# EAGLE design ESP 32 v8 v1 (EAGLE 9.7.0)
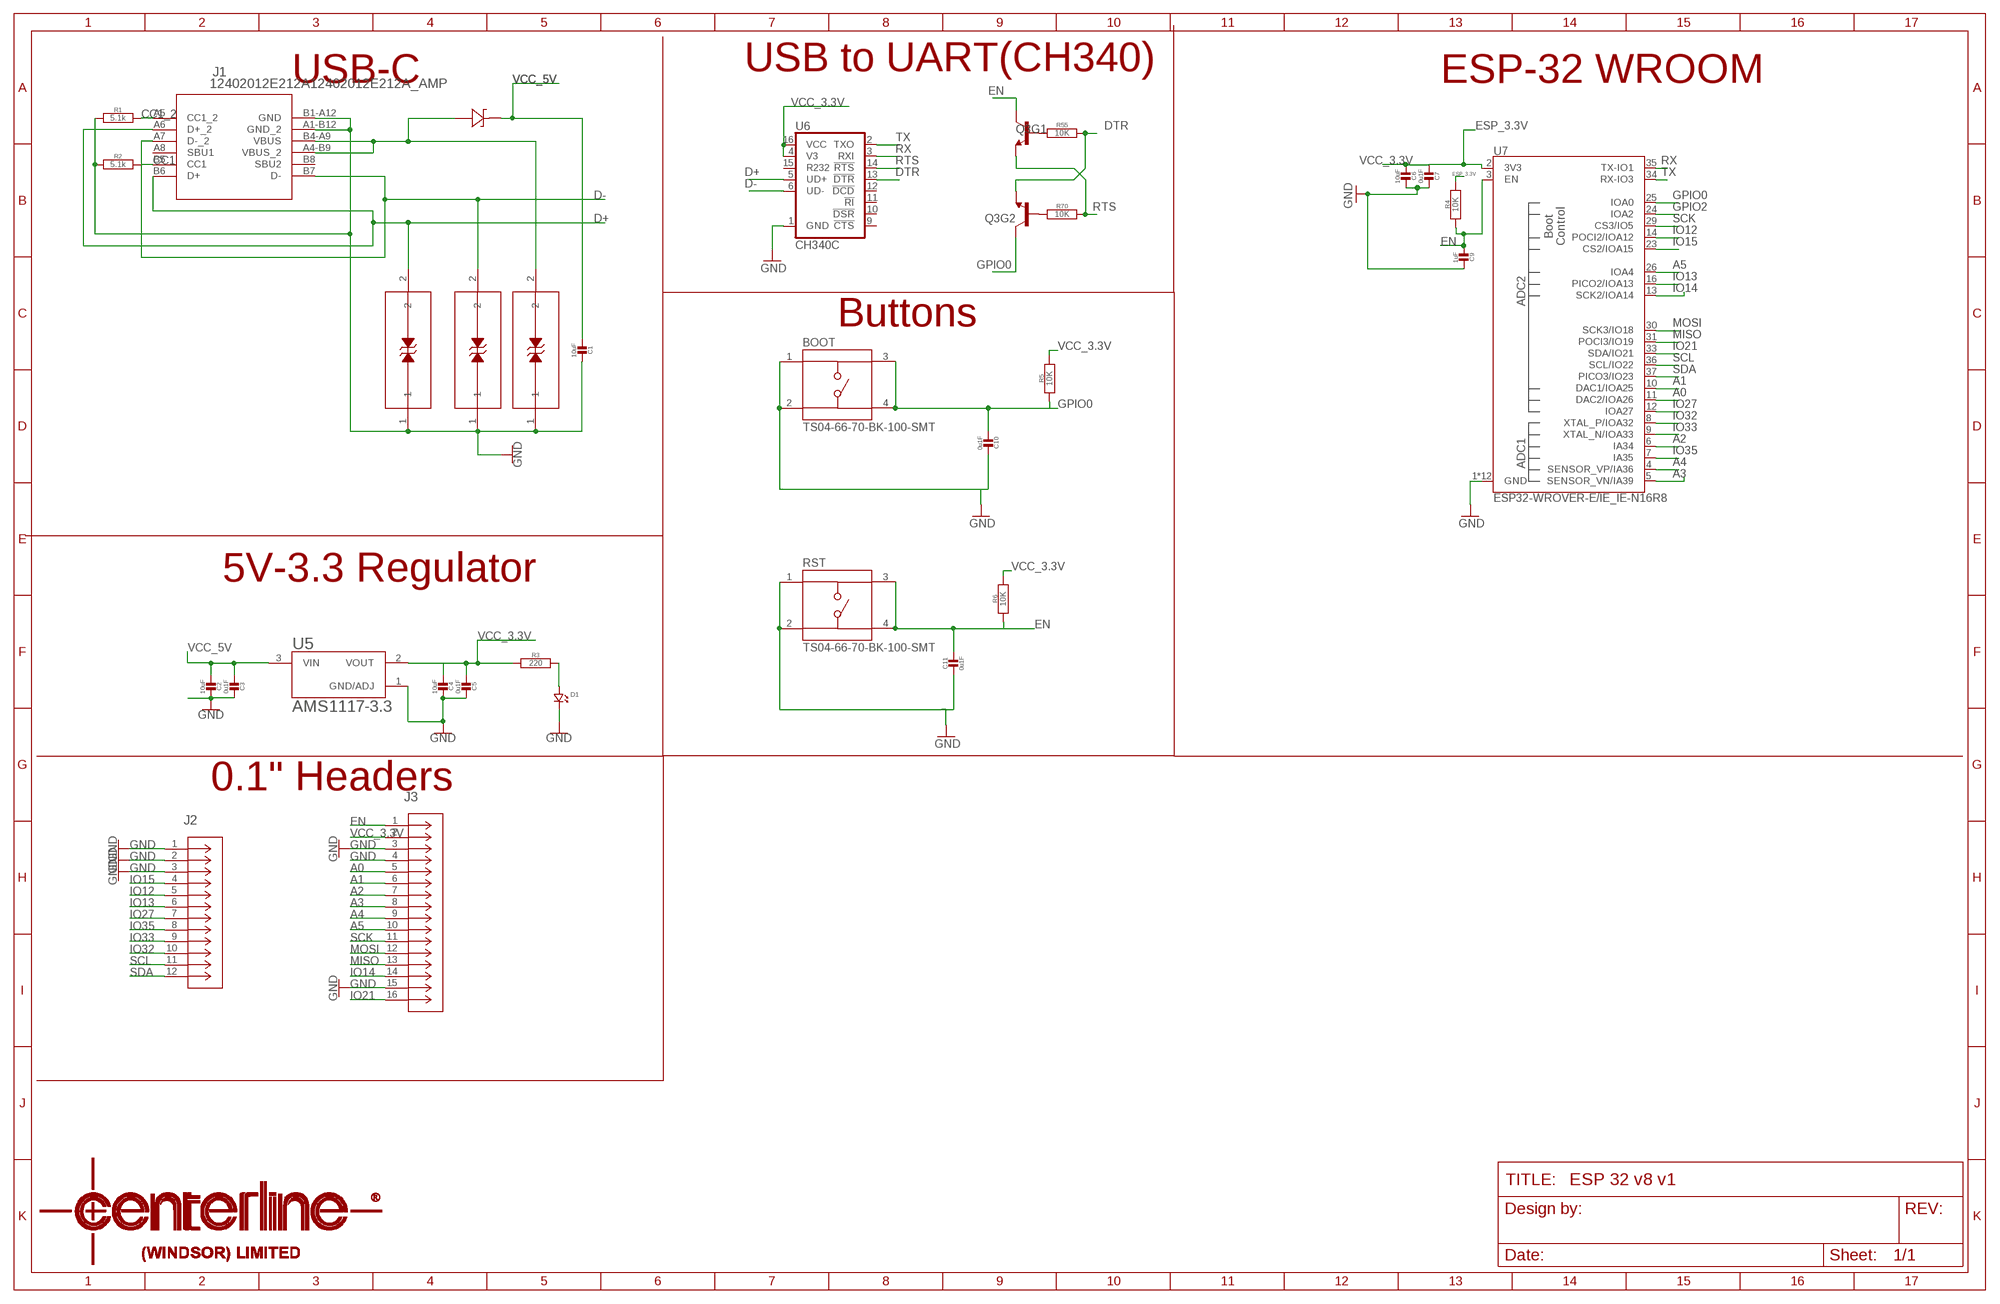
[diagram p0: schematic, sheet 1]

## Parts
BOOT  TS04-66-70-BK-100-SMT  [SW_TS04-66-70-BK-100-SMT]
C1  10uF  CAPACITOR.0603  [0603]
C2  10uF  CAPACITOR.0603  [0603]
C3  0u1F  CAPACITOR.0603  [0603]
C4  10uF  CAPACITOR.0603  [0603]
C5  0u1F  CAPACITOR.0603  [0603]
C6  10uF  CAPACITOR.0603  [0603]
C7  0u1F  CAPACITOR.0603  [0603]
C9  1uF  CAPACITOR.0603  [0603]
C10  0u1F  CAPACITOR.0603  [0603]
C11  0u1F  CAPACITOR.0603  [0603]
CR1  PESD36VS1UJXSC-90_SOD323F_NEX  [SC-90_SOD323F_NEX]
D1  LED.0402  [0402.LED]
J1  12402012E212A12402012E212A_AMP  [12402012E212A_AMP]
J2  61301211121CONN12_1211121_WRE  [CONN12_1211121_WRE]
J3  22032161CONN-4030-CTK16_MOL  [CONN-4030-CTK16_MOL]
Q3  TRANS_NPN_DUAL-MBT3904DW1T1  [SC70-6]
R1  5.1k  RESISTOR.0402  [0402]
R2  5.1k  RESISTOR.0402  [0402]
R3  220  RESISTOR.0402  [0402]
R4  10K  RESISTOR.0603  [0603]
R5  10K  RESISTOR.0603  [0603]
R6  10K  RESISTOR.0603  [0603]
R55  10K  RESISTOR.0603  [0603]
R70  10K  RESISTOR.0603  [0603]
RST  TS04-66-70-BK-100-SMT  [SW_TS04-66-70-BK-100-SMT]
U2  ESD9B5.0ST5GSOD-923_ONS-L  [SOD-923_ONS-L]
U3  ESD9B5.0ST5GSOD-923_ONS-L  [SOD-923_ONS-L]
U4  ESD9B5.0ST5GSOD-923_ONS-L  [SOD-923_ONS-L]
U5  AMS1117-3.3  [SOT229P700X180-4N]
U6  CH340C  [SO016]
U7  ESP32-WROVER-E/IE_IE-N16R8  [ESP32-WROVER-E/IE]

## Nets
A0: J3.5 U7.11(DAC2/IOA26)
A1: J3.6 U7.10(DAC1/IOA25)
A2: J3.7 U7.6(IA34)
A3: J3.8 U7.5(SENSOR_VN/IA39)
A4: J3.9 U7.4(SENSOR_VP/IA36)
A5: J3.10 U7.26(IOA4)
CC1: J1.B5(CC1) R2.2
CC1_2: J1.A5(CC1_2) R1.2
D+: J1.A6(D+_2) J1.B6(D+) U2.2 U6.5(UD+)
D-: J1.A7(D-_2) J1.B7(D-) U3.2 U6.6(UD-)
DTR: Q3.1(E) R55.2 U6.13(!DTR)
EN: C9.1 C11.1 J3.1 Q3.3(C) R4.1 R6.1 RST.3 RST.4 U7.3(EN)
ESP_3.3V: C7.1 R4.2 U7.2(3V3)
GND: BOOT.1 BOOT.2 C1.2 C2.2 C3.2 C4.2 C5.2 C6.2 C7.2 C9.2 C10.2 D1.P$2 J1.A1-B12(GND_2) J1.B1-A12(GND) J2.1 J2.2 J2.3 J3.3 J3.4 J3.15 R1.1 R2.1 U2.1 U3.1 U4.1 U5.1(GND/ADJ) U6.1(GND) U7.1(GND) U7.15(GND) U7.38(GND) U7.GND U7.GNDT1(GND) U7.GNDT2(GND) U7.GNDT3(GND) U7.GNDT4(GND) U7.GNDT5(GND) U7.GNDT6(GND) U7.GNDT7(GND) U7.GNDT8(GND)
GND1: C11.2 RST.1 RST.2
GPIO0: BOOT.3 BOOT.4 C10.1 Q3.6(C) R5.1 U7.25(IOA0)
GPIO2: U7.24(IOA2)
IO12: J2.5 U7.14(POCI2/IOA12)
IO13: J2.6 U7.16(PICO2/IOA13)
IO14: J3.14 U7.13(SCK2/IOA14)
IO15: J2.4 U7.23(CS2/IOA15)
IO21: J3.16 U7.33(SDA/IO21)
IO27: J2.7 U7.12(IOA27)
IO32: J2.10 U7.8(XTAL_P/IOA32)
IO33: J2.9 U7.9(XTAL_N/IOA33)
IO35: J2.8 U7.7(IA35)
MISO: J3.13 U7.31(POCI3/IO19)
MOSI: J3.12 U7.30(SCK3/IO18)
N$1: D1.P$1 R3.2
N$5: Q3.5(B) R55.1
N$11: Q3.2(B) R70.1
RTS: Q3.4(E) R70.2 U6.14(!RTS)
RX: U6.3(RXI) U7.35(TX-IO1)
SCK: J3.11 U7.29(CS3/IO5)
SCL: J2.11 U7.36(SCL/IO22)
SDA: J2.12 U7.37(PICO3/IO23)
TX: U6.2(TXO) U7.34(RX-IO3)
VCC_3.3V: C4.1 C5.1 C6.1 J3.2 R3.1 R5.2 R6.2 U5.2(VOUT) U6.4(V3) U6.16(VCC)
VCC_5V: C1.1 C2.1 C3.1 CR1.1 CR1.2 J1.A4-B9(VBUS_2) J1.B4-A9(VBUS) U4.2 U5.3(VIN)
Unconnected: J1.A8(SBU1) J1.B8(SBU2) U6.9(!CTS) U6.10(!DSR) U6.11(!RI) U6.12(!DCD) U6.15(R232)

## Notes on the sheet
- USB-C | USB to UART(CH340) | ESP-32 WROOM
- Buttons
- 5V-3.3 Regulator
- 0.1" Headers

## Library data of the parts
BOOT RST = TS04-66-70-BK-100-SMT:TS04-66-70-BK-100-SMT; MANUFACTURER: CUI Devices; PARTREV: 1.0; STANDARD: Manufacturer Recommendations
C1-C7 C9-C11 = CL-StandardParts:CAPACITOR
CR1 = 2024-05-29_18-45-12_Library:PESD36VS1UJX; COPYRIGHT: Copyright (C) 2024 Ultra Librarian. All rights reserved.; MANUFACTURER_PART_NUMBER: PESD36VS1UJX; MFR_NAME: Nexperia
D1 = CL-StandardParts:LED
J1 = 2024-08-19_11-27-09_Library:12402012E212A; COPYRIGHT: Copyright (C) 2024 Ultra Librarian. All rights reserved.; MANUFACTURER_PART_NUMBER: 12402012E212A; MFR_NAME: Amphenol ICC
J2 = off12pin:61301211121; COPYRIGHT: Copyright (C) 2024 Ultra Librarian. All rights reserved.; MANUFACTURER_PART_NUMBER: 61301211121; MFR_NAME: Wurth Electronics; TYPE: Headers, Male Pins
J3 = off16:22032161; COPYRIGHT: Copyright (C) 2024 Ultra Librarian. All rights reserved.; MANUFACTURER_PART_NUMBER: 22032161; MFR_NAME: Molex Connector Corporation
Q3 = SparkFun-DiscreteSemi:TRANS_NPN_DUAL: Dual NPN Transistors in Single Package The MBT3904W1 puts two general purpose 3904 NPN transistors in a single package. Datasheet <http://www.onsemi.com/pub_link/Collateral/MBT3904DW1T1-D.PDF> SparkFun Products: SparkFun ESP32 Thing <https://www.sparkfun.com/products/13907>; PROD_ID: TRANS-13337
R1 R2 R4-R6 R55 R70 = CL-StandardParts:RESISTOR
R3 = CL-StandardParts:RESISTOR; SPICEPREFIX: R
U2-U4 = protection diode :ESD9B5.0ST5G; COPYRIGHT: Copyright (C) 2024 Ultra Librarian. All rights reserved.; MANUFACTURER_PART_NUMBER: ESD9B5.0ST5G; MFR_NAME: onsemi
U5 = AMS1117-3.3:AMS1117-3.3: Check availability <https://pricing.snapeda.com/parts/AMS1117-3.3/Advanced%20Monolithic%20Systems/view-part?ref=eda>; AVAILABILITY: Not in stock; CHECK_PRICES: https://www.snapeda.com/parts/AMS1117-3.3/Advanced+Monolithic+Systems/view-part/?ref=eda; DESCRIPTION: Sot223/Pkg 1-Amp 3.3-Volt Low Drop Out Voltage Regulatator; MF: Advanced Monolithic Systems; MP: AMS1117-3.3; PACKAGE: SOT-223 Seeed Technology; PRICE: None; SNAPEDA_LINK: https://www.snapeda.com/parts/AMS1117-3.3/Advanced+Monolithic+Systems/view-part/?ref=snap
U6 = SparkFun-IC-Comms:CH340C; PROD_ID: IC-14038
U7 = SparkFun-RF:ESP32-WROVER-E/IE: ESP32-WROVER-E/IE ESP32-WROVER-E uses the onboard antenna. ESP32-WROVER-IE has a u.FL antenna connector, but is otherwise the same as the -E. N16R8 has 16M Flash, 8M PSRAM; PROD_ID: IC-19265

## Net classes
3 GND: width 0.254 mm

## Board
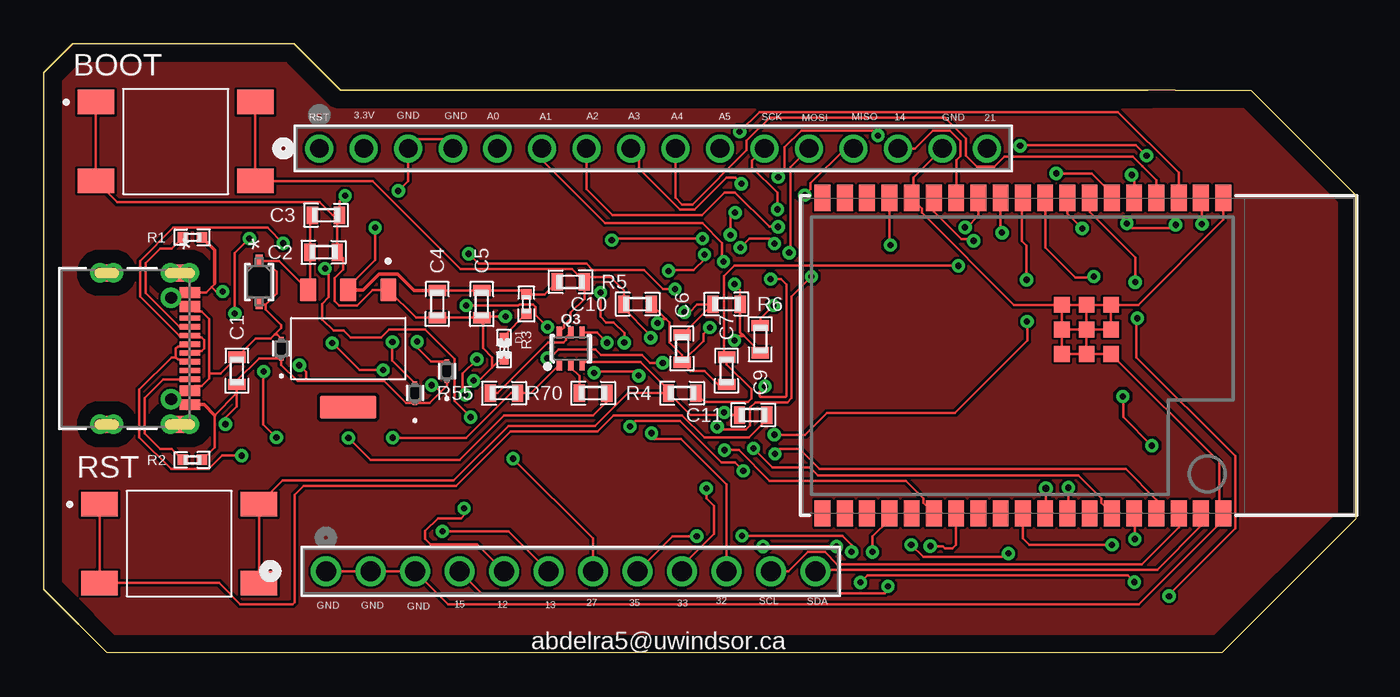
[diagram p1: board, top side]
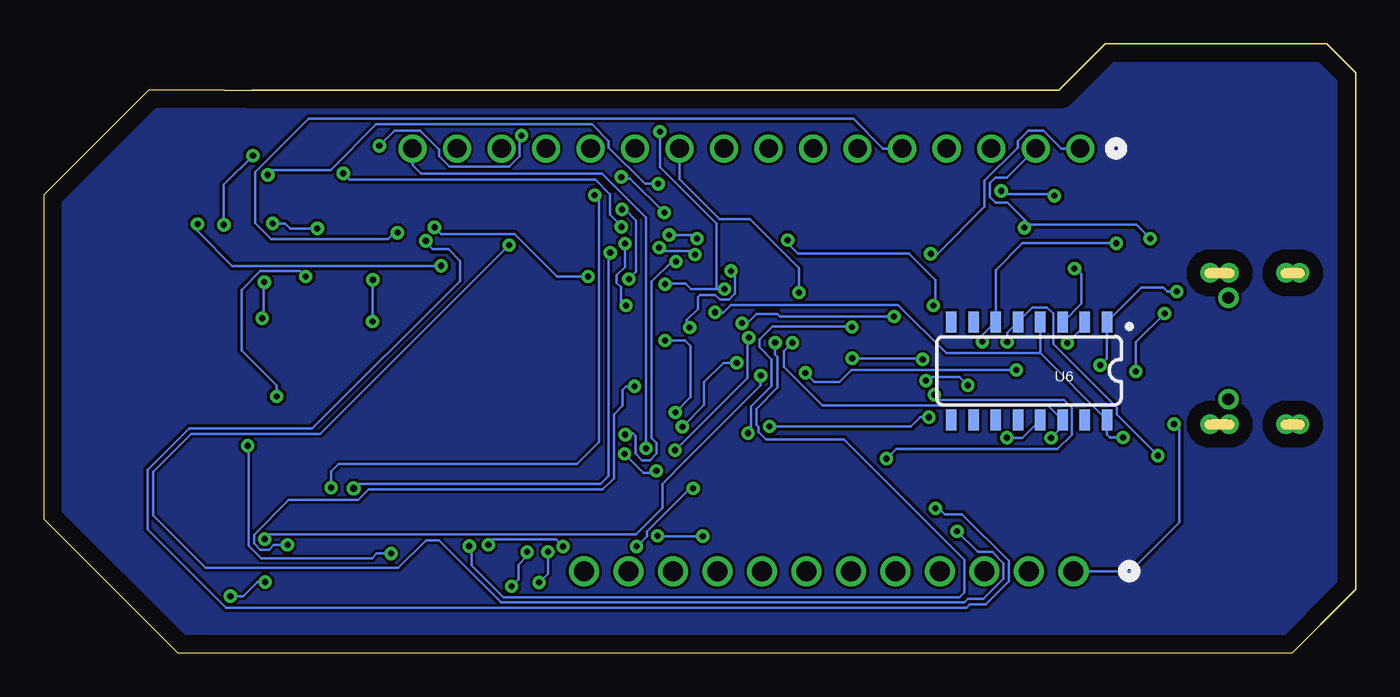
[diagram p2: board, bottom side, seen from below]

Size 74.85 x 34.76 mm. Coordinates in mm from the lower left corner, seen from the top.
Outline: 0,3.61 0,33.11 1.66,34.76 14.28,34.76 16.94,32.11 62.99,32.11 64.57,32.11 68.88,32.11 74.85,26.14 74.85,7.65 67.2,0 46.98,0 3.61,0 0,3.61
Outline: 0,3.61 1.98,1.63
Copper layers (1*16): Top / Bottom
Stack-up Default Layer Stack: Top User Defined 0.035mm / Dielectric-1 User Defined 1.5mm / Bottom User Defined 0.035mm
Design rules: minimum copper width class=3 10mil, minimum copper width 6mil, minimum drill size 0.35mm, copper clearance wire_polygon to wire_polygon 6mil, copper clearance wire_polygon to pad_smd 6mil, copper clearance wire_polygon to via 6mil, copper clearance pad_smd to pad_smd 6mil, copper clearance pad_smd to via 6mil, copper clearance via to via 6mil, copper clearance smd to pad (same net) 6mil, copper clearance smd to via (same net) 6mil, copper clearance smd to smd (same net) 6mil, dimension clearance 40mil, via restrict clearance 0mil, restrict clearance 0mil, drill distance 6mil, keepout clearance 0mil

### Footprints (pad centres in the part's own frame; a part is rotated, then mirrored left to right if it is on the bottom)
SW_TS04-66-70-BK-100-SMT = smd 2.1 x 1.4: 1 -4.55,2.25; 2 -4.55,-2.25; 3 4.55,2.25; 4 4.55,-2.25
0603 = smd 0.65 x 1: 1 -0.775,0; 2 0.775,0
SC-90_SOD323F_NEX = smd 0.711 x 0.406: 1 -1.194,0; 2 1.194,0
0402.LED = smd 0.7 x 0.5: P$1 -0.55,0; P$2 0.55,0
12402012E212A_AMP = smd 0.991 x 2.108: 13 -4.32,3.1; 14 4.32,3.1 | smd 0.991 x 1.803: 15 -4.32,-1.08; 16 4.32,-1.08 | drill 0.66 pad 0.66: 17 -2.89,2.6; 18 2.89,2.6 | smd 0.61 x 1.143: A1-B12 -3.2,3.67; A4-B9 -2.4,3.67; B1-A12 3.2,3.67; B4-A9 2.4,3.67 | smd 0.305 x 1.143: A5 -1.25,3.67; A6 -0.25,3.67; A7 0.25,3.67; A8 1.25,3.67; B5 1.75,3.67; B6 0.75,3.67; B7 -0.75,3.67; B8 -1.75,3.67 | drill 0.61 pad 0.61: S_2_H1 -4.32,3.646; S_2_H2 -4.32,2.554; S_3_H1 4.32,3.646; S_3_H2 4.32,2.554; S_4_H1 -4.32,-0.686; S_4_H2 -4.32,-1.473; S_5_H1 4.32,-0.686; S_5_H2 4.32,-1.473
CONN12_1211121_WRE = drill 1.143 pad 1.651: 1 0,0; 2 2.54,0; 3 5.08,0; 4 7.62,0; 5 10.16,0; 6 12.7,0; 7 15.24,0; 8 17.78,0; 9 20.32,0; 10 22.86,0; 11 25.4,0; 12 27.94,0
CONN-4030-CTK16_MOL = drill 1.067 pad 1.575: 1 0,0; 2 -2.54,0; 3 -5.08,0; 4 -7.62,0; 5 -10.16,0; 6 -12.7,0; 7 -15.24,0; 8 -17.78,0; 9 -20.32,0; 10 -22.86,0; 11 -25.4,0; 12 -27.94,0; 13 -30.48,0; 14 -33.02,0; 15 -35.56,0; 16 -38.1,0
SC70-6 = smd 0.3 x 0.66: 1 -0.65,-0.92; 2 0,-0.92; 3 0.65,-0.92; 4 0.65,0.92; 5 0,0.92; 6 -0.65,0.92
0402 = smd 0.6 x 0.6: 1 -0.55,0; 2 0.55,0
SOD-923_ONS-L = smd 0.229 x 0.254: 1 -0.559,0; 2 0.559,0
SOT229P700X180-4N = smd 1.31 x 0.93: 1 -3.345,2.29; 2 -3.345,0; 3 -3.345,-2.29 | smd 1.31 x 3.24: 4 3.345,0
SO016 = smd 0.6 x 1.2: 1 -4.445,-2.8; 2 -3.175,-2.8; 3 -1.905,-2.8; 4 -0.635,-2.8; 5 0.635,-2.8; 6 1.905,-2.8; 7 3.175,-2.8; 8 4.445,-2.8; 9 4.445,2.8; 10 3.175,2.8; 11 1.905,2.8; 12 0.635,2.8; 13 -0.635,2.8; 14 -1.905,2.8; 15 -3.175,2.8; 16 -4.445,2.8
ESP32-WROVER-E/IE = smd 0.9 x 1.5: 1 7.8,9; 2 6.53,9; 3 5.26,9; 4 3.99,9; 5 2.72,9; 6 1.45,9; 7 0.18,9; 8 -1.09,9; 9 -2.36,9; 10 -3.63,9; 11 -4.9,9; 12 -6.17,9; 13 -7.44,9; 14 -8.71,9; 15 -9.98,9; 16 -11.25,9; 17 -12.52,9; 18 -13.79,9; 19 -15.06,9; 20 -15.06,-9; 21 -13.79,-9; 22 -12.52,-9; 23 -11.25,-9; 24 -9.98,-9; 25 -8.71,-9; 26 -7.44,-9; 27 -6.17,-9; 28 -4.9,-9; 29 -3.63,-9; 30 -2.36,-9; 31 -1.09,-9; 32 0.18,-9; 33 1.45,-9; 34 2.72,-9; 35 3.99,-9; 36 5.26,-9; 37 6.53,-9; 38 7.8,-9 | smd 0.9 x 0.9: GND 0,1.5; GNDT1 -1.4,2.9; GNDT2 -1.4,1.5; GNDT3 -1.4,0.1; GNDT4 0,0.1; GNDT5 1.4,0.1; GNDT6 1.4,1.5; GNDT7 1.4,2.9; GNDT8 0,2.9

### Placement (x,y rotation side)
BOOT  7.52,29.19 0 top
C1  11.02,16.09 270 top
C2  15.96,22.86 0 top
C3  16.1,24.98 0 top
C4  22.45,19.9 270 top
C5  24.99,19.9 270 top
C6  36.42,17.36 270 top
C7  38.96,16.09 270 top
C9  40.88,17.91 90 top
C10  33.88,19.9 0 top
C11  40.47,13.57 0 top
CR1  12.29,21.17 270 top
D1  26.26,17.36 270 top
J1  4.67,17.36 270 top
J2  16.1,4.66 0 top
J3  15.72,28.79 180 top
Q3  30.07,17.36 0 top
R1  8.48,23.71 180 top
R2  8.48,11.01 180 top
R3  27.53,19.9 270 top
R4  36.42,14.82 0 top
R5  30.07,21.17 180 top
R6  38.96,19.9 180 top
R55  26.26,14.82 0 top
R70  31.34,14.82 0 top
RST  7.73,6.23 0 top
U2  21.18,14.82 90 top
U3  23,16.08 90 top
U4  13.56,17.36 90 top
U5  17.37,17.36 270 top
U6  18.64,16.09 180 bottom
U7  59.49,16.96 0 top

### Tracks (layer width: path | path; a pad name or v marks a point on that pad's centre or on a via)
A0  (via drill 0.35)
  Top 0.152: v54.67,23.98 54.59,24.07 U7.11
  Bottom 0.152: J3.5 26.96,28.79 28.66,30.49 59.74,30.49 62.8,27.43 62.8,24.53 61.89,23.62 55.22,23.62 54.86,23.98 v54.67,23.98
A1  (via drill 0.35)
  Top 0.152: J3.6 28.42,28.12 32.02,24.52 37.57,24.52 38.7,23.39 38.7,22.44 38.85,22.28 38.84,22.28 v38.79,22.33 | v41.68,12.45 43.44,12.45 44.68,13.7 52,13.7 56.12,17.82 56.12,18.89 v56.1,18.91 | v56.07,21.29 56.07,23.23 55.81,23.5 55.81,25.91 U7.10
  Bottom 0.152: v38.79,22.33 39.02,22.33 40.17,21.18 40.17,12.27 39.88,11.98 39.88,11.37 40.26,10.99 40.72,10.99 41.1,11.38 41.1,12.39 41.23,12.52 41.61,12.52 v41.68,12.45 | v56.07,21.29 56.1,21.27 v56.1,18.91
A2  (via drill 0.35)
  Top 0.152: J3.7 30.96,26.46 32.44,24.99 37.54,24.99 38.84,26.28 39.43,26.28 41.4,24.32 v41.9,24.32 | U7.6 60.94,26.22 59.79,27.37 v57.76,27.37
  Bottom 0.152: v57.76,27.37 57.75,27.37 57.4,27.01 43.38,27.01 42.53,26.17 42.53,25 41.9,24.37 v41.9,24.32
A3  (via drill 0.35)
  Top 0.152: J3.8 33.95,28.34 33.95,27.63 36.29,25.29 37.13,25.29 38.95,27.12 39.46,27.12 v39.8,26.78 v39.8,26.77 | v62.07,27.28 62.21,27.14 U7.5
  Bottom 0.152: v39.8,26.77 40.55,26.77 42.63,28.85 42.63,29.22 43.58,30.17 55.89,30.17 58.49,27.57 61.79,27.57 v62.07,27.28
A4
  Top 0.152: U7.4 63.48,26.98 62.68,27.78 62.67,27.78 62.13,28.32 54.81,28.32 54.23,27.74 53.24,27.74 52.61,28.37 52.61,29.34 51.4,30.55 41.42,30.55 40.09,29.22 40.09,28.68 37,25.59 36.42,25.59 36.04,25.97 J3.9
A5  (via drill 0.35)
  Top 0.152: U7.26 52.05,6.17 51.84,5.95 51.42,5.95 51.29,6.09 v50.58,6.09 | v31.77,20.57 v31.76,20.56 31.76,19.19 32.09,18.87 32.51,18.87 33.12,18.26 v33.12,17.7
  Bottom 0.152: v50.58,6.09 50.44,5.95 50.44,4.99 48.63,3.18 22.6,3.18 22.32,3.45 22.32,5.32 29.2,12.19 33.66,12.19 34.07,12.6 34.07,12.9 34.19,13.02 34.19,13.93 32.98,15.14 32.98,16.89 33.12,17.03 v33.12,17.7 | v31.77,20.57 31.77,21.95 34.57,24.75 36.29,24.75 38.58,27.04 J3.10
CC1
  Top 0.152: R2.2 7.29,11.65 6.64,11.65 5.75,12.54 5.75,14.56 6.81,15.61 J1.B5
CC1_2
  Top 0.152: J1.A5 7.72,18.61 5.8,20.54 5.8,22.24 6.64,23.08 7.29,23.08 R1.2
D+  (via drill 0.35)
  Top 0.152: v19.88,17.74 19.88,16.68 U2.2 | 7.54,16.87 7.67,16.73 8.22,16.73 J1.B6 | 7.54,16.87 7.54,17.36 7.67,17.5 8.22,17.5 J1.A6 | 7.54,16.87 7.29,16.87 5.45,15.03 5.45,12.31 7.27,10.49 9.42,10.49 10.19,11.25 v11.29,11.25
  Bottom 0.152: v19.88,17.74 19.88,18.28 U6.5 18.44,19.72 17.61,19.72 17.26,19.38 17.26,17.62 13.64,14 13.64,13.6 v11.29,11.25
D-  (via drill 0.35, 0.35 pad 0.43)
  Top 0.152: U3.2 22.09,16.64 21.33,17.39 21.33,17.76 v21.3,17.76 | v13.65,23.37 12.76,24.27 7.4,24.27 5.49,22.37 5.49,20.34 7.72,18.11 J1.B7 8.45,18 9,18 9.14,17.86 9.14,17.37 9,17.23 8.45,17.23 J1.A7
  Bottom 0.152: v21.3,17.76 21.33,17.79 21.33,18.11 U6.6 20.54,21.85 19.01,23.39 v13.67,23.39 v13.65,23.37
DTR  (via drill 0.35)
  Top 0.152: Q3.1 27.8,14.82 R55.2 26.65,14.82 24.11,12.28 v19.9,12.28 | v19.9,12.28
  Bottom 0.152: v19.9,12.28 19.02,12.28 U6.13
EN  (via drill 0.35)
  Top 0.152: Q3.3 30.87,16.6 34.05,16.6 35.64,15.01 R4.1 | RST.4 RST.3 13.62,9.83 23.39,9.83 26.51,12.94 31.46,12.94 33.34,14.82 R4.1 | R4.1 36.89,13.58 38.95,13.58 | v24.24,22.77 24.81,22.21 30.96,22.21 31.3,21.86 34.24,21.86 35.33,20.77 v36.02,20.77 | v39.41,21.04 39.73,20.72 R6.1 39.73,18.28 39.94,18.07 | U7.3 64.75,27.41 61.29,30.87 40.83,30.87 v39.7,29.74 | C11.1 38.95,13.57 38.95,13.58 | 39.94,18.07 C9.1 | 39.94,18.07 39.65,18.07 v39.41,17.83 | v38.82,13.72 v38.82,13.71 38.95,13.58
  Bottom 0.152: J3.1 16.8,28.79 17.83,29.82 18.68,29.82 19.29,29.22 19.29,28.84 21.18,26.95 21.18,25.46 23.87,22.77 v24.24,22.77 | v36.02,20.77 36.46,20.77 | 36.46,20.77 37.93,20.77 38.24,21.08 39.37,21.08 v39.41,21.04 | 36.46,20.77 36.46,24.49 39.7,27.74 v39.7,29.74 | v39.41,17.83 38.27,17.83 37.94,17.5 37.94,14.59 v38.82,13.72
ESP_3.3V  (via drill 0.35)
  Top 0.152: v52.18,22.09 52.16,22.11 39.42,22.11 38.8,21.49 38.8,17.02 C7.1 38.96,16.47 40.37,15.05 40.37,14.51 40.19,14.32 37.69,14.32 R4.2 | U7.2 66.08,25.9 v66.08,24.48
  Bottom 0.152: v52.18,22.09 64.11,22.09 66.08,24.06 v66.08,24.48
GND  (via drill 0.35)
  Top 0.152: C6.2 36.91,16.09 37.69,16.09 38.46,15.32 C7.2 | 35.51,19.05 35.69,18.87 35.69,17.72 36.42,16.99 C6.2 | 35.51,19.05 C10.2 | C1.2 11.02,14.82 | 11.02,14.82 9.75,13.55 9.75,11.73 R2.1 | U2.1 | U2.1 20.68,14.27 19.42,15.52 14.97,15.52 | BOOT.1 BOOT.2 4.2,25.71 15.74,25.71 16.47,24.98 C3.2 | U7.GNDT8 59.49,19.82 59.45,19.86 U7.GNDT1 | 9.75,21.11 9.75,21.05 9.58,20.88 | 9.58,20.88 9.26,20.56 J1.A1-B12 | 9.58,20.88 9.85,20.62 v10.2,20.62 | U7.GNDT7 U7.GNDT8 | 59.59,17.06 U7.GNDT5 67.06,10.89 67.06,8.19 U7.38 67.29,7.58 62.48,2.76 23.08,2.76 J2.3 J2.2 J2.1 | 58.17,17.06 U7.GNDT4 59.59,17.06 | 58.17,17.06 U7.GNDT3 | U7.GNDT1 58.09,17.14 58.17,17.06 | U7.GNDT8 59.49,18.52 | 59.49,18.52 59.49,17.16 59.59,17.06 | U7.GNDT7 62.45,19.86 67.31,24.72 67.31,25.95 U7.1 | U7.GNDT1 55.36,19.86 50.1,25.12 50.1,25.37 U7.15 49.63,25.96 49.62,25.97 49.62,27.12 51.28,28.78 J3.15 | J3.4 22.79,29.33 21.34,29.33 J3.3 20.8,26.94 v20.22,26.37 | C3.2 16.87,25.77 v17.19,26.09 | v10.36,13.05 10.36,13.4 11.02,14.06 11.02,14.82 | U2.1 22.01,14.27 22.01,14.26 22.63,14.88 | 22.63,14.88 23,15.25 U3.1 | 11.02,15.54 12.29,16.81 U4.1 13.56,16.44 14.47,15.52 14.97,15.52 | C3.2 16.73,24.85 C2.2 17.07,22.53 17.07,21.87 16.58,21.38 16.58,20.09 16.85,19.83 17.88,19.83 18.77,20.71 U5.1 21.24,19.13 C4.2 C5.2 25.06,19.2 | 25.06,19.2 v26.34,19.2 | v35.01,18.82 35.25,19.05 35.51,19.05 | U7.GNDT2 59.43,18.46 59.49,18.52 | C6.2 37.63,17.8 37.63,18.2 v38,18.57 | v35.65,21.8 35.69,21.85 37.08,21.85 37.75,22.52 37.75,22.81 37.7,22.76 v37.7,22.74 | v39.74,23.13 40.26,23.65 41.4,23.65 v41.69,23.36 | v41.64,19.83 40.88,19.07 C9.2 | v14.58,16.41 14.97,16.02 14.97,15.52
  Top 0.152: 22.63,14.88 22.24,15.27 v22.12,15.27 | v24.52,15.54 24.83,15.54 25.58,16.29 | 25.58,16.29 26.1,16.81 D1.P$2 | 25.58,16.29 25.58,16.87 25.06,17.39 25.06,19.2 | U7.GND U7.GNDT6 U7.GNDT7
  Top 0.2: J1.B1-A12 9.14,14.16 9.75,13.55 | R1.1 9.75,22.99 9.75,21.11 | 11.02,15.54 C1.2
  Bottom 0.152: v10.2,20.62 10.74,20.62 10.97,20.85 12.24,20.85 U6.1 14.19,16.8 v14.58,16.41 | J2.1 12.85,4.66 10.06,7.46 10.06,12.75 v10.36,13.05 | v35.01,18.82 34.71,18.82 34.17,19.35 32.99,19.35 32.84,19.2 v26.34,19.2 | v35.65,21.8 35.41,21.57 35.41,20.52 35.77,20.16 36.27,20.16 36.54,20.43 37.41,20.43 37.53,20.31 37.53,19.64 38.17,19 38.17,18.74 v38,18.57 | v37.7,22.74 37.7,22.76 37.88,22.94 39.55,22.94 v39.74,23.13 | v41.64,19.83 41.89,19.83 41.92,19.86 41.92,20.86 42.17,21.11 42.17,21.55 41.69,22.02 v41.69,23.36 | v22.12,15.27 22.61,15.76 24.3,15.76 v24.52,15.54 | v17.19,26.09 17.29,26.2 20.05,26.2 v20.22,26.37
GND1
  Top 0.152: RST.1 RST.2 10,3.98 11.2,2.78 14.2,2.78 14.3,2.89 14.3,9 14.83,9.52 23.52,9.52 26.63,12.64 31.59,12.64 32.5,13.55 36.42,13.55 37.69,12.28 40.23,12.28 41.24,13.3 C11.2
GPIO0  (via drill 0.35)
  Top 0.152: Q3.6 29.69,18.56 29.69,18.71 30.07,19.09 30.07,19.42 30.84,20.19 R5.1 | BOOT.3 BOOT.4 18.75,26.94 23.78,21.9 30.13,21.9 R5.1 | U7.25 50.19,8.55 50.19,8.81 49.18,9.82 41.41,9.82 39.66,11.57 v38.84,11.57 | R5.1 31.12,21.46 32.33,21.46 33.1,20.68 C10.1 33.04,19.85 33.04,19.71 34.63,18.12 v34.63,17.99
  Bottom 0.152: v38.84,11.57 38.81,11.57 34.7,15.68 34.7,17.92 v34.63,17.99
IO12  (via drill 0.35)
  Top 0.152: U7.14 50.78,25.19 52.36,23.61 52.97,23.61 v53.05,23.52 | J2.5 24.72,6.2 22.08,6.2 21.77,6.51 21.77,6.95 22.49,7.68 23.8,7.68 24.08,7.95 24.08,8.14 v23.98,8.25
  Bottom 0.152: v23.98,8.25 23.78,8.25 23.45,7.91 22.46,7.91 19.78,5.24 19.78,4.09 21.11,2.76 22.01,2.76 22.2,2.57 64.45,2.57 68.92,7.05 68.92,10.45 66.56,12.81 59.53,12.81 51.11,21.23 51.11,22.37 51.77,23.03 52.68,23.03 53.05,23.41 v53.05,23.52
IO13  (via drill 0.35)
  Top 0.152: U7.16 48.24,23.34 v48.31,23.28 | v22.74,6.93 26.53,6.93 J2.6
  Bottom 0.152: v48.31,23.28 59.08,12.51 66.44,12.51 68.62,10.32 68.62,7.85 65.61,4.84 54.62,4.84 53.05,6.42 52.3,6.42 48.75,2.87 22.33,2.87 22.13,3.07 21.23,3.07 20.09,4.21 20.09,5.11 20.73,5.75 21.56,5.75 v22.74,6.93
IO14
  Top 0.152: J3.14 49.69,28.79 50.72,29.82 51.7,29.82 52.31,29.22 52.31,28.36 52.06,28.12 U7.13
IO15  (via drill 0.35)
  Top 0.152: J2.4 24.99,3.39 47.98,3.39 48.16,3.57 v48.16,3.79 | U7.23 48.24,7.6 47.28,6.64 v47.28,5.75
  Bottom 0.152: v48.16,3.79 47.77,4.19 47.77,5.03 47.28,5.53 47.28,5.68 v47.28,5.75
IO21  (via drill 0.35)
  Top 0.152: U7.33 60.35,8.55 60.35,8.81 59.03,10.12 44.17,10.12 43.71,10.58 41.58,10.58 40.5,11.66 v40.5,11.67
  Bottom 0.152: v40.5,11.67 v40.49,11.67 40.49,24.83 43.01,27.35 53.31,27.35 53.82,27.85 J3.16
IO27  (via drill 0.35)
  Top 0.152: U7.12 53.32,24.95 52.66,24.29 v52.56,24.29 | v43.8,21.47 42.67,20.34 42.67,14.54 42.44,14.31 40.6,14.31 40.29,14 40.29,12.99 40.06,12.75 38.48,12.75 38.42,12.82 v38.42,12.9 | v28.73,16.81 28.7,16.81 28.62,16.89 28.93,16.89 29.36,17.32 31.47,17.32 31.8,16.99 34.14,16.99 34.58,16.55 v35.31,16.55 | v24.71,16.75 23.91,15.95 23.91,14.74 23.91,14.73 v24.04,14.73 | v26.78,11.08 31.34,6.53 J2.7
  Bottom 0.152: v43.8,21.47 45.57,21.47 48,23.9 52.18,23.9 v52.56,24.29 | v38.42,12.9 37.18,14.14 37.18,15.45 36.07,16.55 v35.31,16.55 | v28.73,16.81 24.92,16.81 24.85,16.74 24.72,16.74 v24.71,16.75 | v24.04,14.73 23.74,14.43 16.64,14.43 16.2,13.99 16.2,12.45 17.01,11.64 26.21,11.64 v26.77,11.08 v26.78,11.08
IO32  (via drill 0.35)
  Top 0.152: J2.10 38.96,9.6 36.36,12.2 34.83,12.2 34.68,12.35 v34.68,12.54 | v28.73,18.59 28.05,19.27 28.05,19.75 27.92,19.88 27.13,19.88 27.07,19.82 v24.1,19.82 v24.09,19.82 | v32.4,23.56 32.5,23.66 37.57,23.66 v37.58,23.65 | v39.17,23.85 39.17,24.87 39.43,25.12 v39.45,25.12 | v41.9,27.16 42.27,27.53 42.27,28.86 43.23,29.82 47.29,29.82 v47.59,29.53 | v55.71,28.94 55.76,28.99 62.32,28.99 v62.92,28.39 | U7.8 58.4,25.07 v59.25,24.23 | v61.8,24.51 62.07,24.23 64.38,24.23 v64.58,24.43
  Bottom 0.152: v34.68,12.54 34.5,12.72 34.5,14.05 33.33,15.22 33.33,16.75 34.02,17.45 34.02,17.89 33.28,18.62 28.76,18.62 v28.73,18.59 | v24.09,19.82 23.98,19.94 23.98,21.29 25.48,22.79 31.83,22.79 32.4,23.36 v32.4,23.56 | v37.58,23.65 37.79,23.85 v39.17,23.85 | v39.45,25.12 41.39,27.07 41.81,27.07 v41.9,27.16 | v47.59,29.53 47.71,29.41 47.71,28.36 48.31,27.76 51.7,27.76 52.31,28.36 52.31,28.73 53.39,29.82 54.83,29.82 v55.71,28.94 | v59.25,24.23 60.8,24.23 61.08,24.51 v61.8,24.51 | v64.58,24.43 64.58,26.72 v62.92,28.39
IO33  (via drill 0.35)
  Top 0.152: J2.9 36.42,4.96 38.24,6.78 38.24,8.39 37.8,8.83 v37.8,9.38 | v41.03,6.07 v45.23,6.07 | v49.49,6.16 50.18,5.47 54.66,5.47 54.87,5.67 v55.04,5.67 | v63.22,11.82 61.58,13.46 61.58,14.62 v61.57,14.64 | v59.91,21.48 59.86,21.43 58.85,21.43 57.15,23.13 57.15,25.94 U7.9
  Bottom 0.152: v41.03,6.07 40.44,6.66 40.44,6.93 37.98,9.38 v37.8,9.38 | v45.23,6.07 45.63,6.47 49.25,6.47 49.49,6.23 v49.49,6.16 | v63.22,11.82 63.29,11.75 63.29,11.7 63.16,11.57 63.16,6.11 62.45,5.41 56.12,5.41 55.86,5.67 v55.04,5.67 | v61.57,14.64 61.57,15.26 63.57,17.27 63.57,20.71 62.5,21.78 60.21,21.78 v59.91,21.48
IO35  (via drill 0.35)
  Top 0.152: J2.8 35.87,6.66 v37.26,6.66 | v39.83,6.68 45.58,6.68 46.09,6.17 v46.09,5.77 | v46.59,4.01 46.99,4.42 61.85,4.42 v62.22,4.04 | v64.21,3.23 64.21,3.35 67.97,7.12 67.97,11.24 62.34,16.87 62.34,19.05 v62.39,19.1 | v62.27,21.16 62.27,22.56 62.27,22.57 59.67,25.17 U7.7
  Bottom 0.152: v37.26,6.66 39.47,6.66 39.56,6.74 39.77,6.74 v39.83,6.68 | v46.09,5.77 46.09,4.51 v46.59,4.02 v46.59,4.01 | v62.22,4.04 62.66,4.04 63.47,3.23 v64.21,3.23 | v62.39,19.1 62.32,19.17 62.32,21.11 v62.27,21.16
MISO  (via drill 0.35)
  Top 0.152: v58.46,9.43 58.46,8.02 U7.31 | v43.42,26.12 43.75,26.46 43.75,26.81 45.74,28.79 J3.13
  Bottom 0.152: v58.46,9.43 58.46,10.35 58.02,10.78 44.43,10.78 43.18,12.03 43.18,25.95 43.35,26.12 v43.42,26.12
MOSI  (via drill 0.35, 0.4)
  Top 0.152: J3.12 42.6,27.74 42.6,22.91 v42.53,22.84 | U7.30 57.18,8.01 57.18,9.37 v57.18,9.39
  Bottom 0.152: v42.53,22.84 42.63,22.73 42.63,10.09 43.07,9.65 56.93,9.65 v57.18,9.39
N$1
  Top 0.152: R3.2 26.26,18.08 D1.P$1
N$5
  Top 0.152: Q3.5 29.79,18.01 29.79,17.86 29.66,17.73 28.78,17.73 25.88,14.82 R55.1
N$11
  Top 0.152: R70.1 30.56,15.8 30.07,16.29 Q3.2
RTS  (via drill 0.35)
  Top 0.152: Q3.4 31.55,18.28 v32.14,17.7 | v17.38,12.27 18.63,11.01 23.72,11.01 26.26,13.55 31.34,13.55 32.11,14.33 R70.2
  Bottom 0.152: v32.14,17.7 32.62,17.22 32.62,16.33 30.42,14.12 17.56,14.12 U6.14 16.73,12.92 v17.38,12.27
RX  (via drill 0.35)
  Top 0.152: v41.71,11.35 42,11.64 43.11,11.64 44.26,10.5 61.73,10.5 63.48,8.74 U7.35 | v33.44,12.92 33.77,13.24 36.29,13.24 38.68,10.86 39.43,10.86 v39.9,10.39 | v24.35,13.45 23.43,14.36 23.43,16.77 21.74,18.46 19.7,18.46 19.24,18 17.5,18 17.11,18.39 | 17.11,18.39 16.52,18.39 15.87,19.04 15.87,19.91 16.26,20.29 16.26,21.72 v16.04,21.93 | 17.11,18.39
  Bottom 0.152: U6.3 16.68,18.89 15.65,19.93 15.65,21.63 15.94,21.93 v16.04,21.93 | v41.71,11.35 40.64,10.28 40.01,10.28 v39.9,10.39 | v33.44,12.92 25.36,12.92 24.83,13.45 v24.35,13.45
S$1
  pour Top: -3.39,37.79 76.67,37.79 76.67,-6.51 -3.39,-6.51 -3.39,37.78
S$2
  pour Bottom: -3.36,37.79 76.5,37.79 76.5,-7.1 -3.28,-7.1 -3.28,37.69 -3.41,37.69
SCK  (via drill 0.35)
  Top 0.152: U7.29 55.86,6.54 56.25,6.16 v60.95,6.16 | v41.86,25.31 41.86,26.26 40.41,27.71 40.41,28.08 J3.11 | v41.47,21.33 42.05,21.33 42.37,21.01 42.37,14.67 42.31,14.61 40.89,14.61 40.83,14.68 40.83,14.9 v41.14,15.21
  Bottom 0.152: v60.95,6.16 61.72,6.16 62,5.88 62.5,5.88 62.86,6.24 62.86,6.74 60.87,8.73 56.91,8.73 56.32,9.32 42.97,9.32 42.32,9.97 42.32,13.62 41.83,14.11 41.83,15.01 41.63,15.21 v41.14,15.21 | v41.47,21.33 41.05,21.75 41.05,24.67 41.69,25.31 v41.86,25.31
SCL
  Top 0.152: J2.11 42.5,4.66 43.59,5.75 44.56,5.75 45.26,5.05 62.65,5.05 64.75,7.15 U7.36
SDA
  Top 0.152: J2.12 44.11,4.74 63.53,4.74 66.02,7.24 U7.37
TX  (via drill 0.35)
  Top 0.152: v16.44,17.69 16.47,17.69 18.02,16.14 v19.35,16.14 | v31.39,15.98 31.48,16.07 33.69,16.07 v33.94,15.82 | U7.34 62.25,7.92 v62.25,6.49
  Bottom 0.152: v19.35,16.14 28.77,16.14 29.46,15.46 30.87,15.46 v31.39,15.98 | v62.25,6.49 61.97,6.77 41.05,6.77 39.56,8.26 39.56,9.65 38.23,10.98 38.23,10.97 33.95,15.25 33.95,15.81 v33.94,15.82 | U6.2 15.46,18.67 v16.44,17.69
VCC_3.3V  (via drill 0.35)
  Top 0.152: R5.2 28.57,20.45 R3.1 27.3,20.68 C5.1 C4.1 | C6.1 R6.2 38.17,19.89 37.28,19.89 36.83,19.44 v36.56,19.44 | v18.9,24.26 18.9,22.42 17.42,20.94 17.42,20.71 | v13.27,12.29 12.51,13.05 12.51,16.03 v12.54,16.06 | v10.9,19.37 10.9,22.81 v11.73,23.64
  Top 0.2: C4.1 21.12,20.68 20.18,21.62 19.13,21.62 18.22,20.71 17.42,20.71 U5.2
  Bottom 0.152: v36.56,19.44 36.07,19.44 35.65,19.85 26.11,19.85 23.37,17.1 18,17.1 | J3.2 19.91,27.13 20.56,27.13 20.87,26.82 20.87,26.02 20.57,25.71 19.88,25.71 18.9,24.73 | 18.9,24.73 v18.9,24.26 | U6.4 18,17.1 | 18,17.1 U6.16 14.19,12.46 14.02,12.29 v13.27,12.29 | v12.54,16.06 12.54,17.73 v10.9,19.37 | v11.73,23.64 12.52,24.43 18.6,24.43 18.9,24.73
VCC_5V
  Top 0.152: 13.17,18.16 12.94,17.93 12.08,17.93 C1.1 10.09,15.95 9.44,15.95 | 13.17,18.16 13.56,18.55 13.56,18.72 12.67,19.61 12.67,19.88 | 13.17,18.16 13.31,18.16 U4.2 | C3.1 15.18,24.85 C2.1 15.18,20.82 U5.3 13.42,22.37 CR1.1 12.56,22.09 12.96,22.09 13.29,21.76 13.29,20.5 12.67,19.88 | J1.A4-B9 8.6,19.5 9,19.5 9.44,19.06 9.44,15.95 | J1.B4-A9 8.6,15.23 9,15.23 9.44,15.67 9.44,15.95 | CR1.2 12.39,19.88 12.67,19.88

### Text on the board
tNames: RST | 3.3V | GND | GND | A0 | A1 | A2 | A3 | A4 | A5 | SCK | MOSI | MISO | 14 | GND | 21 | 15 | 12 | 13 | 27 | 35 | 33 | 32 | SCL | SDA | GND | GND | GND | abdelra5@uwindsor.ca